# Altium schematic sheet 2-MCU.SchDoc: RD15002_SingleSCT.PrjPcb
size A4; DrawnBy: 邓勇杰; Revision: A1.0.0; SheetNumber: 3; SheetTotal: 10; Time: 2015/12/2
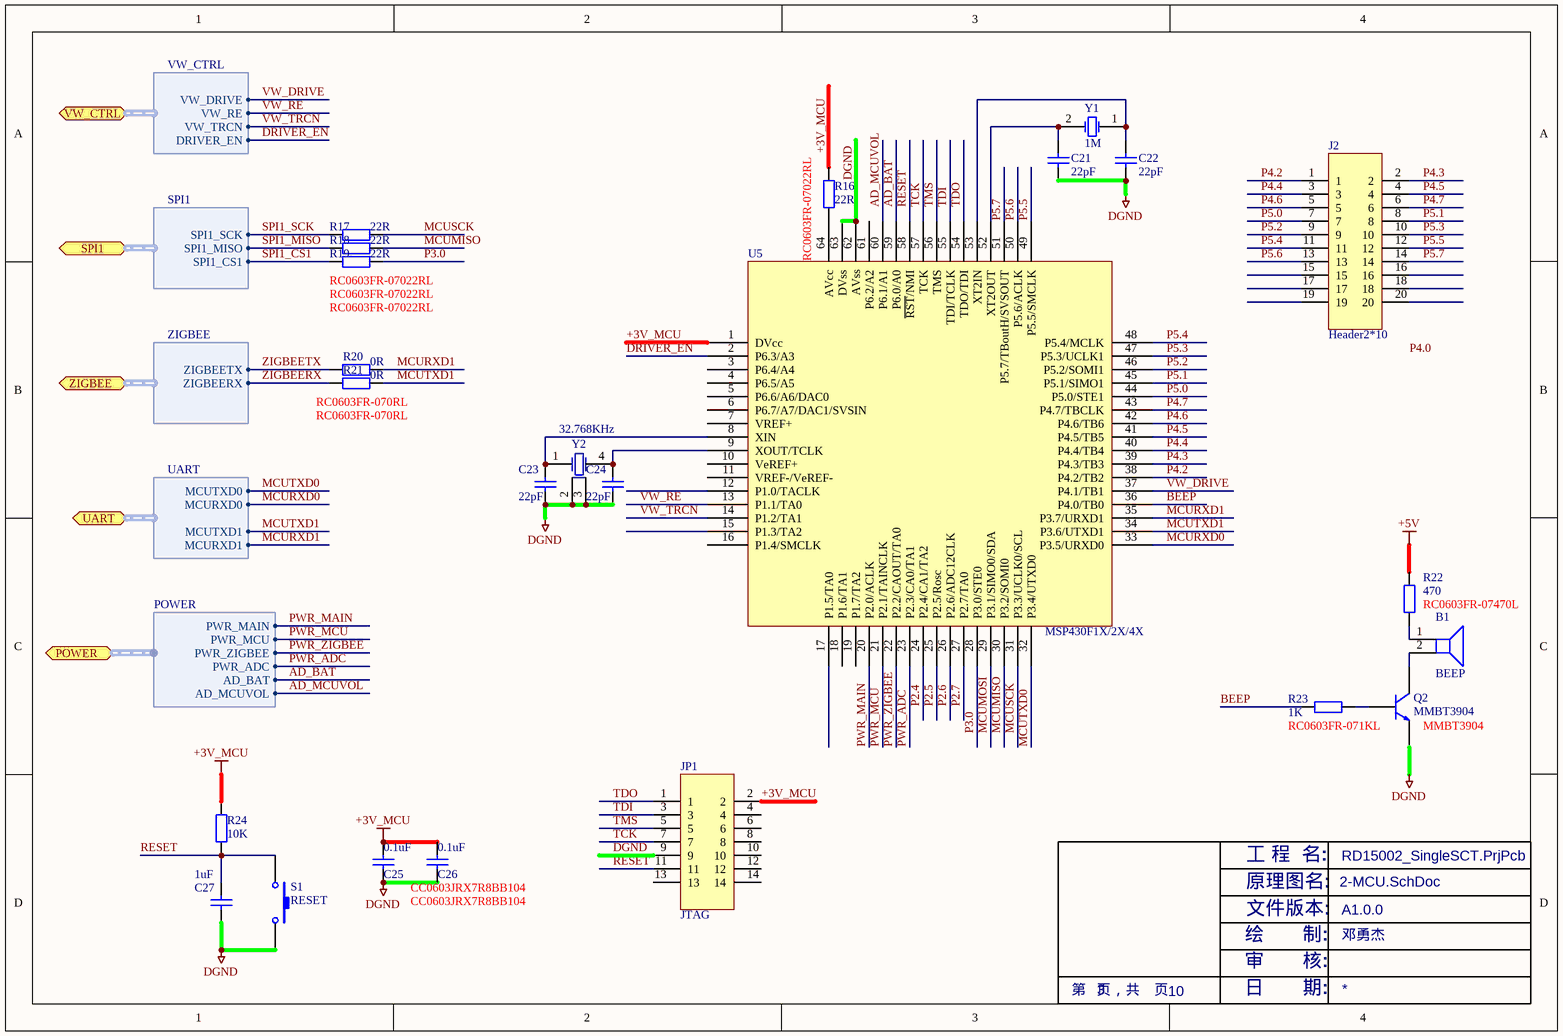
[diagram p0: 2-MCU.SchDoc]

## Parts
B1  BEEP  [BUZZER-5V]
C21  22pF  [CC0603]
C22  22pF  [CC0603]
C23  22pF  [CC0603]
C24  22pF  [CC0603]
C25  0.1uF  Type No.: CC0603JRX7R8BB104  [CC0603]
C26  0.1uF  Type No.: CC0603JRX7R8BB104  [CC0603]
C27  1uF  [CC0603]
J2  Header2*10  [IDC20-2.0MM]
JP1  JTAG  [IDC14-2.0MM]
Q2  MMBT3904  [SOT-23W]
R16  22R  Type No.: RC0603FR-07022RL  [CC0603]
R17  22R  Type No.: RC0603FR-07022RL  [CC0603]
R18  22R  Type No.: RC0603FR-07022RL  [CC0603]
R19  22R  Type No.: RC0603FR-07022RL  [CC0603]
R20  0R  Type No.: RC0603FR-070RL  [CC0603]
R21  0R  Type No.: RC0603FR-070RL  [CC0603]
R22  470  Type No.: RC0603FR-07470L  [CC0603]
R23  1K  Type No.: RC0603FR-071KL  [CC0603]
R24  10K  [CC0603]
S1  RESET  [SPST]
U5  MSP430F1X/2X/4X  [LQFP64]
Y1  1M  [XCYAI]
Y2  32.768KHz  [MC-146]

## Ports
POWER (harness POWER), SPI1 (harness SPI1), UART (harness UART), VW_CTRL (harness VW_CTRL), ZIGBEE (harness ZIGBEE)

## Harnesses
UART: MCUTXD0, MCUTXD1, MCURXD0, MCURXD1
ZIGBEE: ZIGBEETX, ZIGBEERX
POWER: AD_BAT, PWR_MAIN, PWR_MCU, PWR_ZIGBEE, PWR_ADC, AD_MCUVOL
SPI1: SPI1_SCK, SPI1_MISO, SPI1_CS1
VW_CTRL: VW_RE, VW_DRIVE, VW_TRCN, DRIVER_EN

## Nets
+3V_MCU: C25.2 C26.2 JP1.2 R16.2 R24.2 U5.1(DVcc)
+5V: R22.2
DGND: C21.1 C22.1 C23.2 C24.2 C25.1 C26.1 C27.1 JP1.9 Q2.2 S1.1 U5.62(AVss) U5.63(DVss) Y2.2(GND) Y2.3(GND)
AD_BAT: U5.59(P6.0/A0) ; port POWER.AD_BAT
AD_MCUVOL: U5.60(P6.1/A1) ; port POWER.AD_MCUVOL
BEEP: R23.2 U5.36(P4.0/TB0)
DRIVER_EN: U5.2(P6.3/A3) ; port VW_CTRL.DRIVER_EN
MCUMISO: R18.1 U5.30(P3.2/SOMI0)
MCUMOSI: U5.29(P3.1/SIMO0/SDA)
MCURXD0: U5.33(P3.5/URXD0) ; port UART.MCURXD0
MCURXD1: R20.1 U5.35(P3.7/URXD1) ; port UART.MCURXD1
MCUSCK: R17.1 U5.31(P3.3/UCLK0/SCL)
MCUTXD0: U5.32(P3.4/UTXD0) ; port UART.MCUTXD0
MCUTXD1: R21.1 U5.34(P3.6/UTXD1) ; port UART.MCUTXD1
P2.4: U5.24(P2.4/CA1/TA2)
P2.5: U5.25(P2.5/Rosc)
P2.6: U5.26(P2.6/ADC12CLK)
P2.7: U5.27(P2.7/TA0)
P3.0: R19.1 U5.28(P3.0/STE0)
P4.2: J2.1 U5.38(P4.2/TB2)
P4.3: J2.2 U5.39(P4.3/TB3)
P4.4: J2.3 U5.40(P4.4/TB4)
P4.5: J2.4 U5.41(P4.5/TB5)
P4.6: J2.5 U5.42(P4.6/TB6)
P4.7: J2.6 U5.43(P4.7/TBCLK)
P5.0: J2.7 U5.44(P5.0/STE1)
P5.1: J2.8 U5.45(P5.1/SIMO1)
P5.2: J2.9 U5.46(P5.2/SOMI1)
P5.3: J2.10 U5.47(P5.3/UCLK1)
P5.4: J2.11 U5.48(P5.4/MCLK)
P5.5: J2.12 U5.49(P5.5/SMCLK)
P5.6: J2.13 U5.50(P5.6/ACLK)
P5.7: J2.14 U5.51(P5.7/TBoutH/SVSOUT)
PWR_ADC: U5.23(P2.3/CA0/TA1) ; port POWER.PWR_ADC
PWR_MAIN: U5.20(P2.0/ACLK) ; port POWER.PWR_MAIN
PWR_MCU: U5.21(P2.1/TAINCLK) ; port POWER.PWR_MCU
PWR_ZIGBEE: U5.22(P2.2/CAOUT/TA0) ; port POWER.PWR_ZIGBEE
RESET: C27.2 JP1.11 R24.1 S1.2 U5.58(~{RST}/NMI)
SPI1_CS1: R19.2 ; port SPI1.SPI1_CS1
SPI1_MISO: R18.2 ; port SPI1.SPI1_MISO
SPI1_SCK: R17.2 ; port SPI1.SPI1_SCK
TCK: JP1.7 U5.57(TCK)
TDI: JP1.3 U5.55(TDI/TCLK)
TDO: JP1.1 U5.54(TDO/TDI)
TMS: JP1.5 U5.56(TMS)
VW_DRIVE: U5.37(P4.1/TB1) ; port VW_CTRL.VW_DRIVE
VW_RE: U5.13(P1.1/TA0) ; port VW_CTRL.VW_RE
VW_TRCN: U5.14(P1.2/TA1) ; port VW_CTRL.VW_TRCN
ZIGBEERX: R21.2 ; port ZIGBEE.ZIGBEERX
ZIGBEETX: R20.2 ; port ZIGBEE.ZIGBEETX
NetB1_1: B1.1 R22.1
NetB1_2: B1.2 Q2.3
NetC21_2: C21.2 U5.52(XT2OUT) Y1.2(OSC2)
NetC22_2: C22.2 U5.53(XT2IN) Y1.1(OSC1)
NetC23_1: C23.1 U5.8(XIN) Y2.1(X1)
NetC24_1: C24.1 U5.9(XOUT/TCLK) Y2.4(X2)
NetQ2_1: Q2.1 R23.1
NetR16_1: R16.1 U5.64(AVcc)

Not connected (* = marked no-connect by the designer): J2 15 16 17 18 19 20; JP1 4 6 8 10 12 13 14; U5 3(P6.4/A4) 4(P6.5/A5) 5(P6.6/A6/DAC0) 6(P6.7/A7/DAC1/SVSIN) 7(VREF+) 10(VeREF+) 11(VREF-/VeREF-) 12(P1.0/TACLK) 15(P1.3/TA2) 16(P1.4/SMCLK) 17(P1.5/TA0) 18(P1.6/TA1) 19(P1.7/TA2) 61(P6.2/A2)

## Notes on the sheet
- Labels drawn without touching a wire or pin: P4.0
- 文件版本:
- 原理图名:
- 工 程  名:
- 绘       制:
- 审       核:
- 第   页，共    页
- 日       期:

## Library data of the parts
C21-C24 C27 = Cap: Capacitor; Value: 100pF; Published: 8-Jun-2000; LatestRevisionDate: 17-Jul-2002; LatestRevisionNote: Re-released for DXP Platform.; PackageReference: RAD-0.3; Publisher: Altium Limited
C25 C26 = Cap: Capacitor
JP1 = Header2*7
Q2 = NPN: Type No.: MMBT3904
R16-R23 = Res2: Resistor
R24 = Res2: Resistor; Value: 1K; Published: 8-Jun-2000; LatestRevisionDate: 17-Jul-2002; LatestRevisionNote: Re-released for DXP Platform.; PackageReference: AXIAL-0.4; Publisher: Altium Limited
S1 = SW-PB: Switch; Published: 24-Mar-1999; LatestRevisionDate: 17-Jul-2002; LatestRevisionNote: Re-released for DXP Platform.; PackageReference: SPST-2; Publisher: Altium Limited
Y1 = XTAL: Crystal Oscillator; Published: 8-Jun-2000; LatestRevisionDate: 17-Jul-2002; LatestRevisionNote: Re-released for DXP Platform.; PackageReference: R38; Publisher: Altium Limited
Y2 = MC-146
B1 = BEEP: Dimension: 9*5.5mm 3.3V